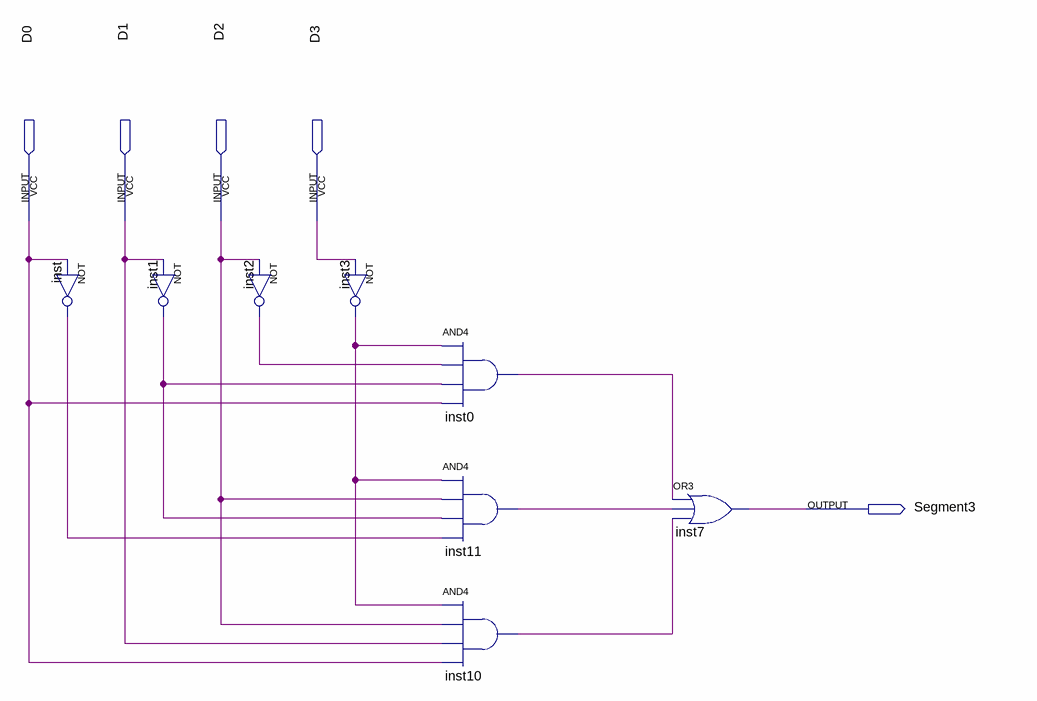
[diagram p0: schematic sheet]
// Quartus schematic Lab2.bdf as structural Verilog: 8 symbols, 5 pins
module Lab2 (
  input  D0,
  input  D1,
  input  D2,
  input  D3,
  output Segment3
);

  wire inst0_out, inst1_out, inst2_out, inst3_out, inst10_out, inst11_out, inst_out;

  not inst (inst_out, D0);
  not inst1 (inst1_out, D1);
  not inst2 (inst2_out, D2);
  not inst3 (inst3_out, D3);
  and inst0 (inst0_out, inst3_out, inst2_out, inst1_out, D0);
  and inst11 (inst11_out, inst3_out, D2, inst1_out, inst_out);
  and inst10 (inst10_out, inst3_out, D2, D1, D0);
  or inst7 (Segment3, inst0_out, inst11_out, inst10_out);
endmodule
